# Altium project PPT_Controller.PrjPcb
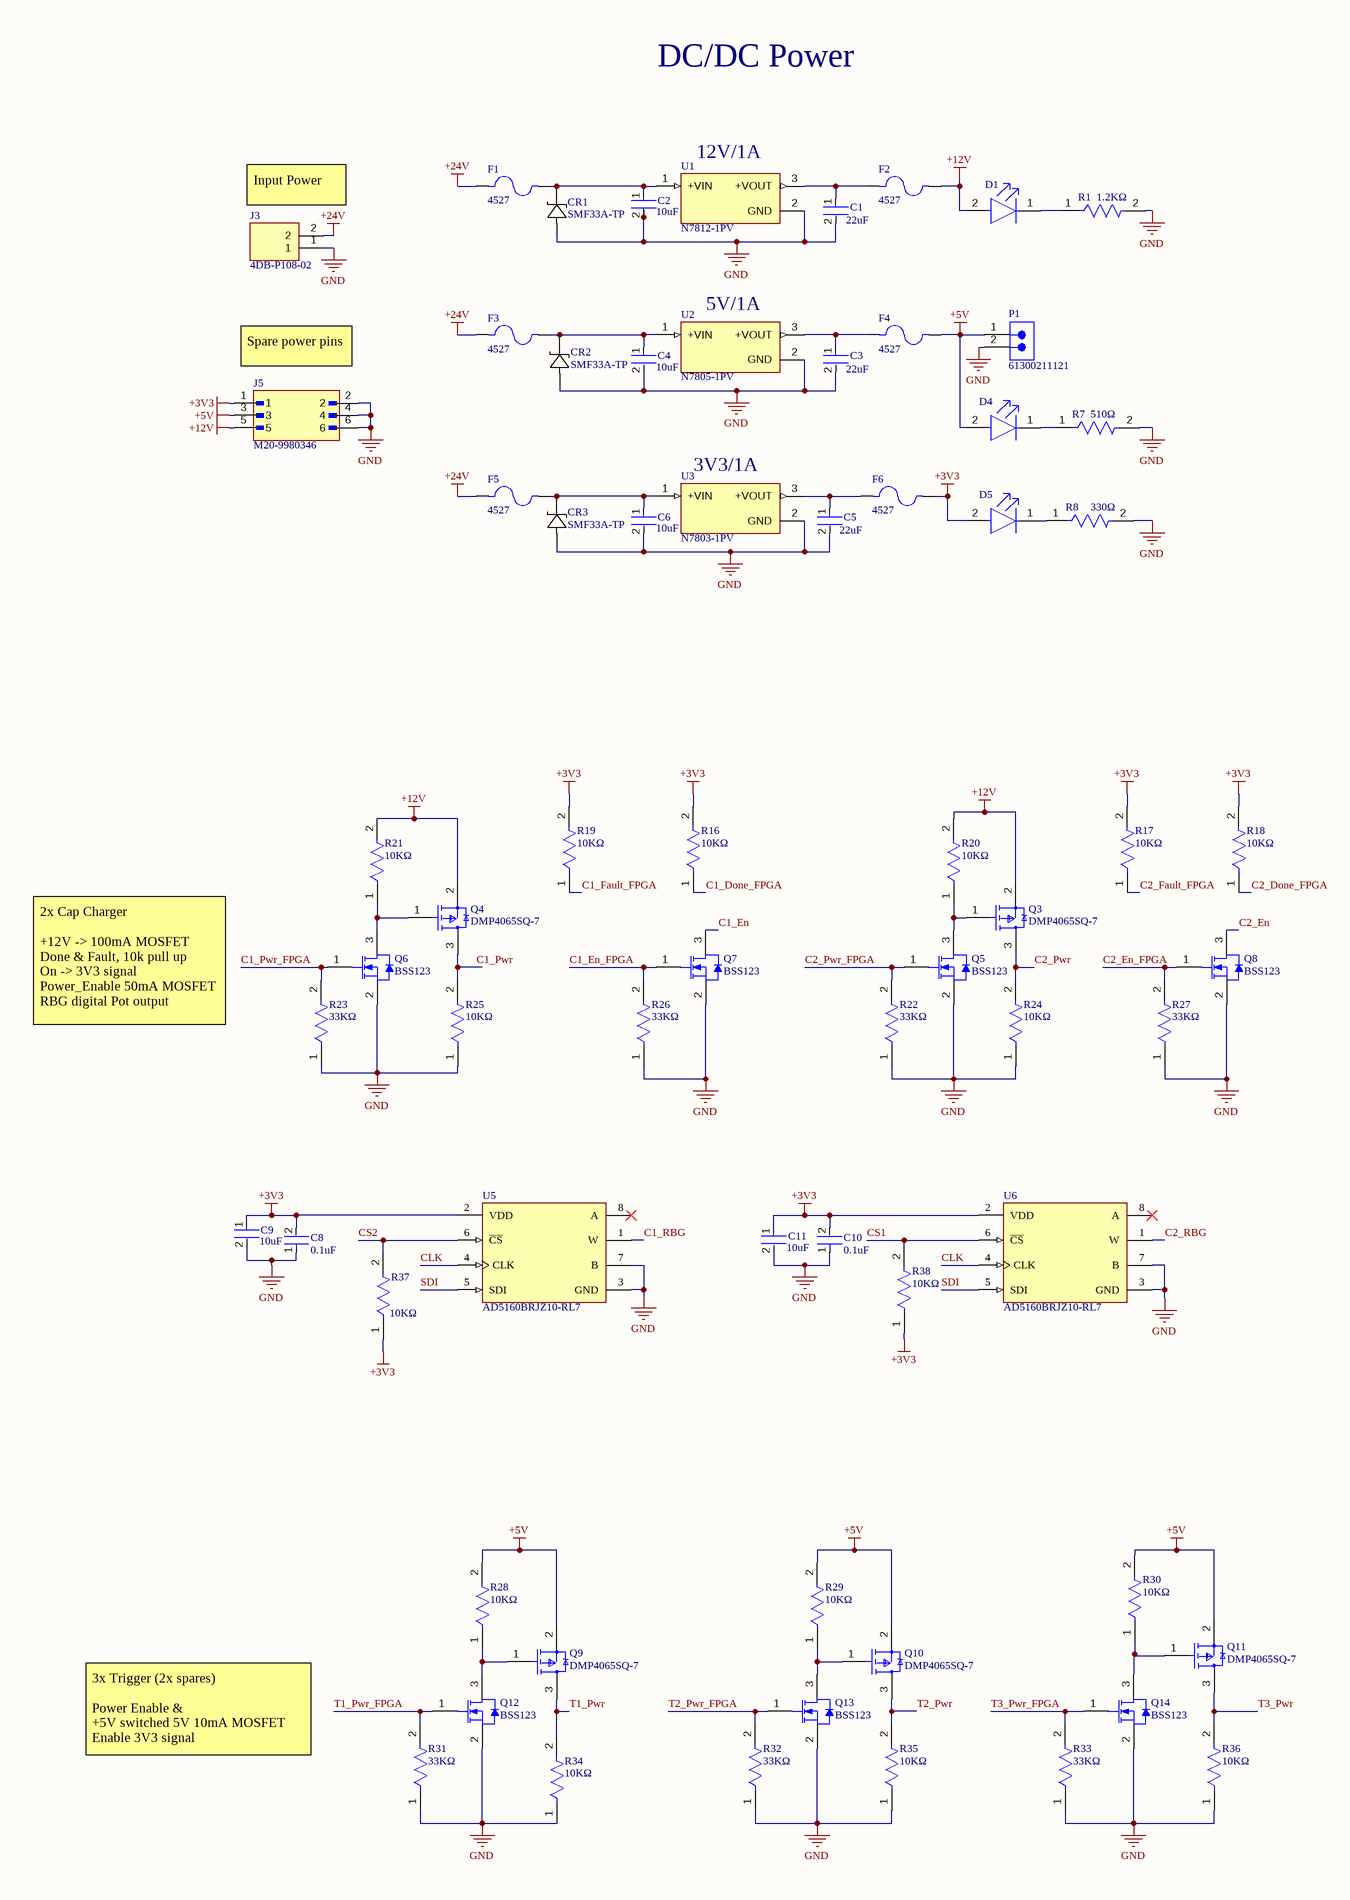
[diagram p0: Controller.SchDoc, left]
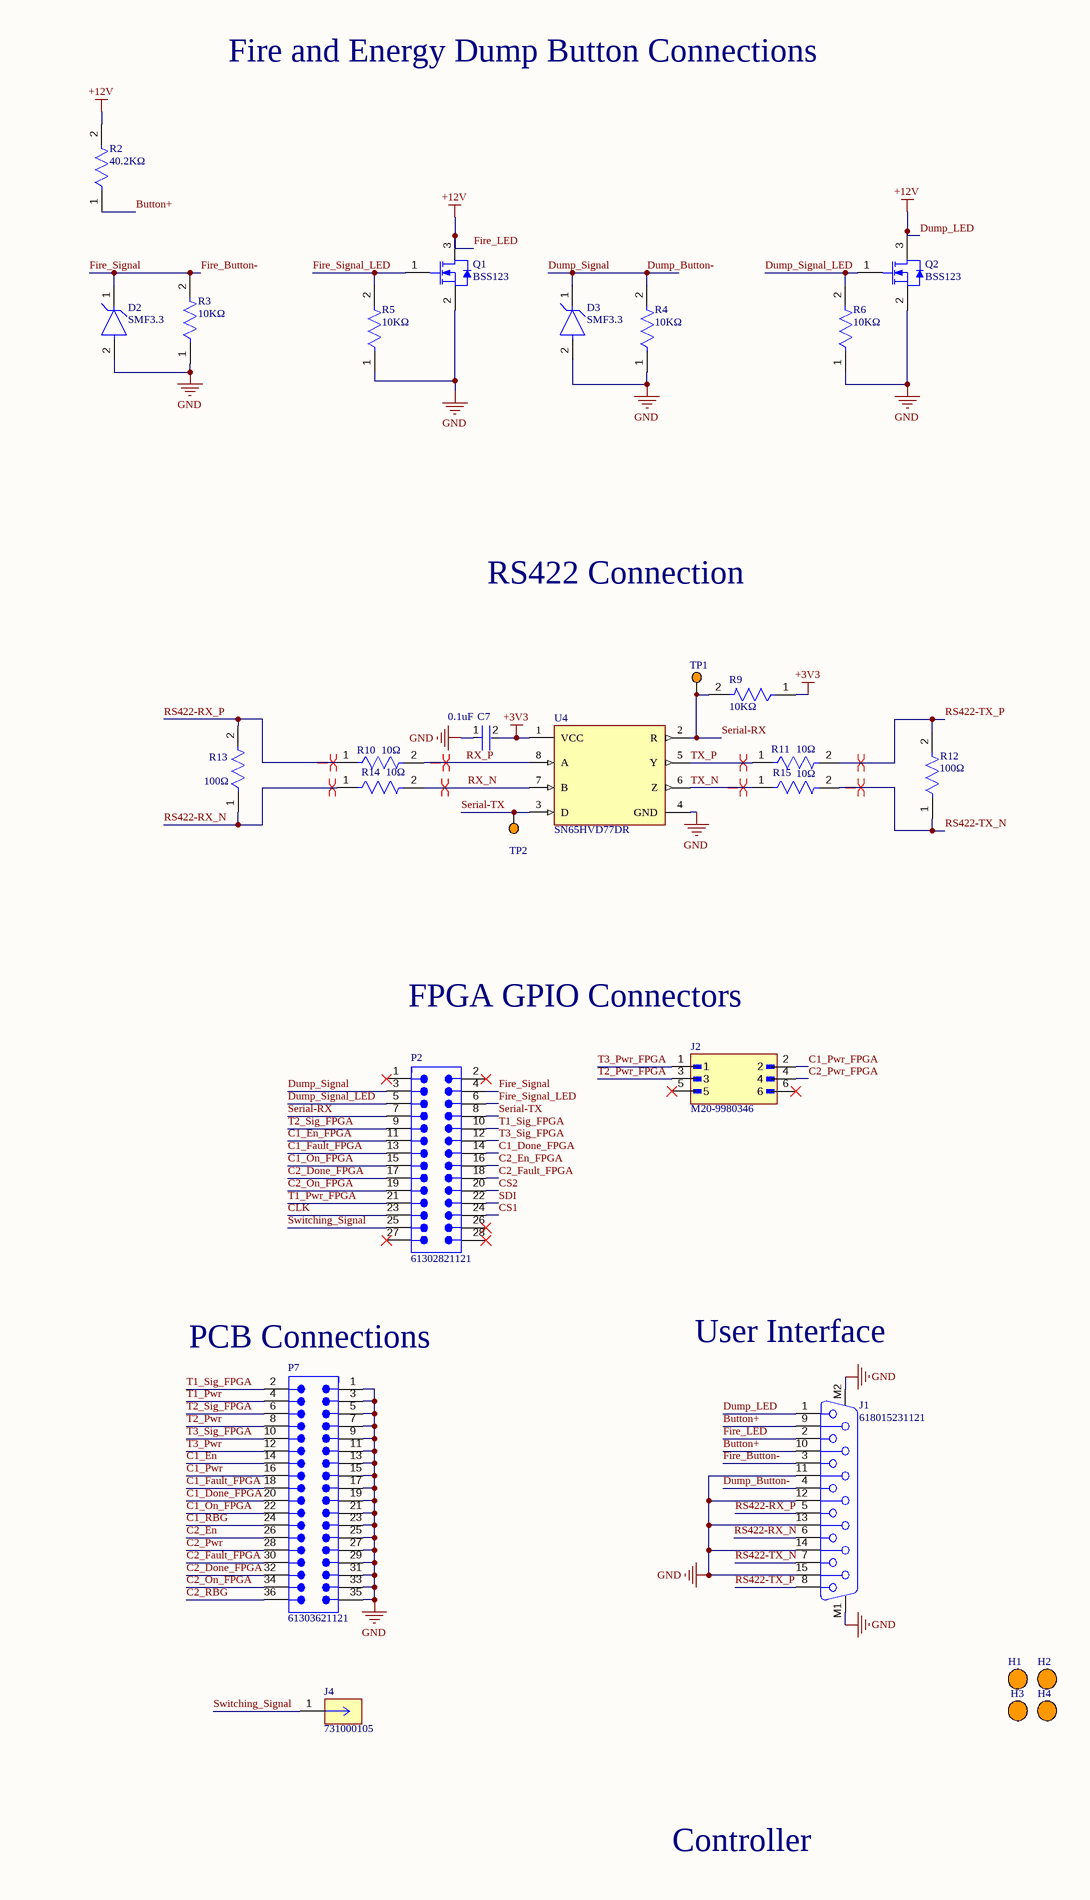
[diagram p1: Controller.SchDoc, right]
1 sheet, 97 parts. Net scope: global (net labels, ports and power ports of the same name join across sheets).
Board files: Controller.PcbDoc, fpga.PcbDoc

## Sheet Controller.SchDoc
size 558 x 431 mm; SheetNumber: 1; SheetTotal: 1

### Parts
C1  Capacitance: 22uF  [FP-CC0805-0_2-1_45-IPC_C]  (hidden comment: CC0805MKX5R8BB226)
C2  Capacitance: 10uF  [FP-CL32-IPC_C]  (hidden comment: CL32B106KBJNNNE)
C3  Capacitance: 22uF  [FP-CC0805-0_2-1_45-IPC_C]  (hidden comment: CC0805MKX5R8BB226)
C4  Capacitance: 10uF  [FP-CL32-IPC_C]  (hidden comment: CL32B106KBJNNNE)
C5  Capacitance: 22uF  [FP-CC0805-0_2-1_45-IPC_C]  (hidden comment: CC0805MKX5R8BB226)
C6  Capacitance: 10uF  [FP-CL32-IPC_C]  (hidden comment: CL32B106KBJNNNE)
C7  0.1uF  [FP-CC0603-DA-IPC_A]
C8  0.1uF  [FP-CC0603-DA-IPC_A]
C9  Capacitance: 10uF  [FP-CL32-IPC_C]  (hidden comment: CL32B106KBJNNNE)
C10  0.1uF  [FP-CC0603-DA-IPC_A]
C11  Capacitance: 10uF  [FP-CL32-IPC_C]  (hidden comment: CL32B106KBJNNNE)
CR1  SMF33A-TP  [SOD-123FL_MCC]
CR2  SMF33A-TP  [SOD-123FL_MCC]
CR3  SMF33A-TP  [SOD-123FL_MCC]
D1  LTST-C190GKT  [FP-LTST-C190GKT-MFG]  (value not drawn)
D2  SMF3.3  [FP-SMF3_3-MFG]
D3  SMF3.3  [FP-SMF3_3-MFG]
D4  LTST-C190GKT  [FP-LTST-C190GKT-MFG]  (value not drawn)
D5  LTST-C190GKT  [FP-LTST-C190GKT-MFG]  (value not drawn)
F1  4527  [FUSE_4527]
F2  4527  [FUSE_4527]
F3  4527  [FUSE_4527]
F4  4527  [FUSE_4527]
F5  4527  [FUSE_4527]
F6  4527  [FUSE_4527]
H1  M3_Hole  [M3_Hole]  (value not drawn)
H2  M3_Hole  [M3_Hole]  (value not drawn)
H3  M3_Hole  [M3_Hole]  (value not drawn)
H4  M3_Hole  [M3_Hole]  (value not drawn)
J1  618015231121  [618015231121]
J2  M20-9980346  [HARWIN_M20-9980346]
J3  4DB-P108-02  [TE_2-1437667-4]
J4  731000105  [CONN_73100-0105_MOL]
J5  M20-9980346  [HARWIN_M20-9980346]
P1  61300211121  [61300211121]
P2  61302821121  [61302821121]
P7  61303621121  [61303621121]
Q1  BSS123  [FAIR-SOT23-3_V]
Q2  BSS123  [FAIR-SOT23-3_V]
Q3  DMP4065SQ-7  [FP-SOT23-IPC_C]
Q4  DMP4065SQ-7  [FP-SOT23-IPC_C]
Q5  BSS123  [FAIR-SOT23-3_V]
Q6  BSS123  [FAIR-SOT23-3_V]
Q7  BSS123  [FAIR-SOT23-3_V]
Q8  BSS123  [FAIR-SOT23-3_V]
Q9  DMP4065SQ-7  [FP-SOT23-IPC_C]
Q10  DMP4065SQ-7  [FP-SOT23-IPC_C]
Q11  DMP4065SQ-7  [FP-SOT23-IPC_C]
Q12  BSS123  [FAIR-SOT23-3_V]
Q13  BSS123  [FAIR-SOT23-3_V]
Q14  BSS123  [FAIR-SOT23-3_V]
R1  Resistance: 1.2KΩ  [FP-RT0805-MFG]  (hidden comment: RT0805FRE071K2L)
R2  Resistance: 40.2KΩ  [FP-RT0805-MFG]  (hidden comment: RT0805BRE0740K2L)
R3  value 10KΩ  [FP-RT0805-MFG]  (hidden comment: RT0805FRE0710KL)
R4  value 10KΩ  [FP-RT0805-MFG]  (hidden comment: RT0805FRE0710KL)
R5  value 10KΩ  [FP-RT0805-MFG]  (hidden comment: RT0805FRE0710KL)
R6  value 10KΩ  [FP-RT0805-MFG]  (hidden comment: RT0805FRE0710KL)
R7  Resistance: 510Ω  [FP-RT0805-MFG]  (hidden comment: RT0805FRE07510RL)
R8  Resistance: 330Ω  [FP-RT0805-MFG]  (hidden comment: RT0805FRE07330RL)
R9  value 10KΩ  [FP-RT0805-MFG]  (hidden comment: RT0805FRE0710KL)
R10  value 10Ω  [FP-RT0805-MFG]  (hidden comment: RT0805FRE0710RL)
R11  value 10Ω  [FP-RT0805-MFG]  (hidden comment: RT0805FRE0710RL)
R12  Resistance: 100Ω  [FP-RT0805-MFG]  (hidden comment: RT0805FRE07100RL)
R13  Resistance: 100Ω  [FP-RT0805-MFG]  (hidden comment: RT0805FRE07100RL)
R14  value 10Ω  [FP-RT0805-MFG]  (hidden comment: RT0805FRE0710RL)
R15  value 10Ω  [FP-RT0805-MFG]  (hidden comment: RT0805FRE0710RL)
R16  value 10KΩ  [FP-RT0805-MFG]  (hidden comment: RT0805FRE0710KL)
R17  value 10KΩ  [FP-RT0805-MFG]  (hidden comment: RT0805FRE0710KL)
R18  value 10KΩ  [FP-RT0805-MFG]  (hidden comment: RT0805FRE0710KL)
R19  value 10KΩ  [FP-RT0805-MFG]  (hidden comment: RT0805FRE0710KL)
R20  value 10KΩ  [FP-RT0805-MFG]  (hidden comment: RT0805FRE0710KL)
R21  value 10KΩ  [FP-RT0805-MFG]  (hidden comment: RT0805FRE0710KL)
R22  value 33KΩ  [FP-RT0805-MFG]  (hidden comment: RT0805BRD0733KL)
R23  value 33KΩ  [FP-RT0805-MFG]  (hidden comment: RT0805BRD0733KL)
R24  value 10KΩ  [FP-RT0805-MFG]  (hidden comment: RT0805FRE0710KL)
R25  value 10KΩ  [FP-RT0805-MFG]  (hidden comment: RT0805FRE0710KL)
R26  value 33KΩ  [FP-RT0805-MFG]  (hidden comment: RT0805BRD0733KL)
R27  value 33KΩ  [FP-RT0805-MFG]  (hidden comment: RT0805BRD0733KL)
R28  value 10KΩ  [FP-RT0805-MFG]  (hidden comment: RT0805FRE0710KL)
R29  value 10KΩ  [FP-RT0805-MFG]  (hidden comment: RT0805FRE0710KL)
R30  value 10KΩ  [FP-RT0805-MFG]  (hidden comment: RT0805FRE0710KL)
R31  value 33KΩ  [FP-RT0805-MFG]  (hidden comment: RT0805BRD0733KL)
R32  value 33KΩ  [FP-RT0805-MFG]  (hidden comment: RT0805BRD0733KL)
R33  value 33KΩ  [FP-RT0805-MFG]  (hidden comment: RT0805BRD0733KL)
R34  value 10KΩ  [FP-RT0805-MFG]  (hidden comment: RT0805FRE0710KL)
R35  value 10KΩ  [FP-RT0805-MFG]  (hidden comment: RT0805FRE0710KL)
R36  value 10KΩ  [FP-RT0805-MFG]  (hidden comment: RT0805FRE0710KL)
R37  value 10KΩ  [FP-RT0805-MFG]  (hidden comment: RT0805FRE0710KL)
R38  value 10KΩ  [FP-RT0805-MFG]  (hidden comment: RT0805FRE0710KL)
TP1  Test Point  [Test_Pad]  (value not drawn)
TP2  Test Point  [Test_Pad]  (value not drawn)
U1  N7812-1PV  [CONV_TSR_1-2433]
U2  N7805-1PV  [CONV_TSR_1-2433]
U3  N7803-1PV  [CONV_TSR_1-2433]
U4  SN65HVD77DR  [FP-D0008A-IPC_C]
U5  AD5160BRJZ10-RL7  [FP-RJ-8-IPC_B]
U6  AD5160BRJZ10-RL7  [FP-RJ-8-IPC_B]

### Nets
+3V3: C7.2 C8.2 C9.1 C10.2 C11.1 D5.2(A) F6.2 J5.1 R9.1 R16.2 R17.2 R18.2 R19.2 R37.1 R38.1 U4.1(VCC) U5.2(VDD) U6.2(VDD)
+5V: D4.2(A) F4.2 J5.3 P1.1 Q9.2(S) Q10.2(S) Q11.2(S) R28.2 R29.2 R30.2
+24V: F1.1 F3.1 F5.1 J3.2
Dump_LED: D1.2(A) F2.2 J1.1 J1.2 J5.5 Q1.3(D) Q2.3(D) Q3.2(S) Q4.2(S) R2.2 R20.2 R21.2  [also labelled +12V, Fire_LED]
GND: C1.2 C2.2 C3.2 C4.2 C5.2 C6.2 C7.1 C8.1 C9.2 C10.1 C11.2 CR1.2 CR2.2 CR3.2 D2.2(A) D3.2(A) J1.11 J1.12 J1.13 J1.14 J1.15 J1.M1 J1.M2 J3.1 J5.2 J5.4 J5.6 P1.2 P7.1 P7.3 P7.5 P7.7 P7.9 P7.11 P7.13 P7.15 P7.17 P7.19 P7.21 P7.23 P7.25 P7.27 P7.29 P7.31 P7.33 P7.35 Q1.2(S) Q2.2(S) Q5.2(S) Q6.2(S) Q7.2(S) Q8.2(S) Q12.2(S) Q13.2(S) Q14.2(S) R1.2 R3.1 R4.1 R5.1 R6.1 R7.2 R8.2 R22.1 R23.1 R24.1 R25.1 R26.1 R27.1 R31.1 R32.1 R33.1 R34.1 R35.1 R36.1 U1.2(GND) U2.2(GND) U3.2(GND) U4.4(GND) U5.3(GND) U5.7(B) U6.3(GND) U6.7(B)
Button+: J1.9 J1.10 R2.1
C1_Done_FPGA: P2.14 P7.20 R16.1
C1_En: P7.14 Q7.3(D)
C1_En_FPGA: P2.11 Q7.1(G) R26.2
C1_Fault_FPGA: P2.13 P7.18 R19.1
C1_On_FPGA: P2.15 P7.22
C1_Pwr: P7.16 Q4.3(D) R25.2
C1_Pwr_FPGA: J2.2 Q6.1(G) R23.2
C1_RBG: P7.24 U5.1(W)
C2_Done_FPGA: P2.17 P7.32 R18.1
C2_En: P7.26 Q8.3(D)
C2_En_FPGA: P2.16 Q8.1(G) R27.2
C2_Fault_FPGA: P2.18 P7.30 R17.1
C2_On_FPGA: P2.19 P7.34
C2_Pwr: P7.28 Q3.3(D) R24.2
C2_Pwr_FPGA: J2.4 Q5.1(G) R22.2
C2_RBG: P7.36 U6.1(W)
CLK: P2.23 U5.4(CLK) U6.4(CLK)
CS1: P2.24 R38.2 U6.6(~{CS})
CS2: P2.20 R37.2 U5.6(~{CS})
Dump_Button-: D3.1(C) J1.4 P2.3 R4.2  [also labelled Dump_Signal]
Dump_Signal_LED: P2.5 Q2.1(G) R6.2
Fire_Button-: D2.1(C) J1.3 P2.4 R3.2  [also labelled Fire_Signal]
Fire_Signal_LED: P2.6 Q1.1(G) R5.2
RS422-RX_N: J1.6 R13.1 R14.1
RS422-RX_P: J1.5 R10.1 R13.2
RS422-TX_N: J1.7 R12.1 R15.2
RS422-TX_P: J1.8 R11.2 R12.2
RX_N: R14.2 U4.7(B)
RX_P: R10.2 U4.8(A)
SDI: P2.22 U5.5(SDI) U6.5(SDI)
Serial-RX: P2.7 R9.2 TP1.1(T) U4.2(R)
Serial-TX: P2.8 TP2.1(T) U4.3(D)
Switching_Signal: J4.1 P2.25
T1_Pwr: P7.4 Q9.3(D) R34.2
T1_Pwr_FPGA: P2.21 Q12.1(G) R31.2
T1_Sig_FPGA: P2.10 P7.2
T2_Pwr: P7.8 Q10.3(D) R35.2
T2_Pwr_FPGA: J2.3 Q13.1(G) R32.2
T2_Sig_FPGA: P2.9 P7.6
T3_Pwr: P7.12 Q11.3(D) R36.2
T3_Pwr_FPGA: J2.1 Q14.1(G) R33.2
T3_Sig_FPGA: P2.12 P7.10
TX_N: R15.1 U4.6(Z)
TX_P: R11.1 U4.5(Y)
NetC1_1: C1.1 F2.1 U1.3(+VOUT)
NetC2_1: C2.1 CR1.1 F1.2 U1.1(+VIN)
NetC3_1: C3.1 F4.1 U2.3(+VOUT)
NetC4_1: C4.1 CR2.1 F3.2 U2.1(+VIN)
NetC5_1: C5.1 F6.1 U3.3(+VOUT)
NetC6_1: C6.1 CR3.1 F5.2 U3.1(+VIN)
NetD1_1: D1.1(C) R1.1
NetD4_1: D4.1(C) R7.1
NetD5_1: D5.1(C) R8.1
NetQ3_1: Q3.1(G) Q5.3(D) R20.1
NetQ4_1: Q4.1(G) Q6.3(D) R21.1
NetQ9_1: Q9.1(G) Q12.3(D) R28.1
NetQ10_1: Q10.1(G) Q13.3(D) R29.1
NetQ11_1: Q11.1(G) Q14.3(D) R30.1

Not connected (* = marked no-connect by the designer): J2 5* 6*; P2 1* 2* 26* 27* 28*; U5 8(A)*; U6 8(A)*

### Layout directives
differential pair: RS422-RX_N, RS422-RX_P, RS422-TX_N, RS422-TX_P, RX_N, RX_P, TX_N, TX_P

### Notes on the sheet
- DC/DC Power
- Fire and Energy Dump Button Connections
- (near U1) 12V/1A
- (near J3) Input Power
- (near J5) Spare power pins
- (near U2) 5V/1A
- (near U3) 3V3/1A
- RS422 Connection
- 2x Cap Charger
  +12V -> 100mA MOSFET
  Done & Fault, 10k pull up
  On -> 3V3 signal
  Power_Enable 50mA MOSFET
  RBG digital Pot output
- FPGA GPIO Connectors
- (near P7) PCB Connections
- User Interface
- 3x Trigger (2x spares)
  Power Enable &
  +5V switched 5V 10mA MOSFET
  Enable 3V3 signal
- Controller
- DWG. NO.
- REV.
- SHT.
- REVISION
- DESCRIPTION
- DATE
- APPROVED
- THIS DOCUMENT AND THE DATA DISCLOSED HEREIN OR HEREWITH IS THE PROPERTY OF ALTIUM LIMITED AND MAY BE FREELY DISTRIBUTED IN WHOLE. NO RIGHTS ARE RESERVED OR EXPRESS OR IMPLIED WARANTEE GIVEN.
- ENG:
- DSN:
- APPROVALS
- PROJECT
- DOCUMENT REVISION:
- DESIGN ITEM:
- CHK:
- BOM:
- REFERENCE DOCUMENTS
- PROJECT REVISION:
- TITLE
- FAB DWG:
- PCB DWG:
- ASSY DWG:
- SCALE:
- SIZE
- C
- CAGE CODE
- FILE NAME
- DWG NO.
- SHEET
- OF
- REV

### Library data of the parts
C1 C3 C5 = CMP-03422-001497-1: CAP CER 22UF 25V X5R 0805; Tolerance: 20%; Max Operating Temperature: 85°C; Dielectric: X5R; Termination: SMD/SMT; Voltage Rating: 25V; Width: 0.049inch; Min Operating Temperature: -55°C; Case/Package: 0805; Lead Free: Lead Free; RoHS Compliant: Yes; Weight: 0.000194oz; Voltage Rating (DC): 25V; Length: 0.079inch; Halogen Free: Halogen Free; Height: 1.25mm; Packaging: Tape and Reel; Package Quantity: 3000; Case Code (Metric): 2012; Thickness: 0.057inch; Case Code (Imperial): 0805; Mount: Surface Mount
C2 C4 C6 C9 C11 = CMP-2000-06110-2: Cap Ceramic 10uF 50V X7R ±10% SMD 1210 +125°C Embossed T/R; Material: Ceramic; Min Operating Temperature: -55°C; Depth: 2.5mm; Radiation Hardening: No; Packaging: Tape and Reel; Dielectric: X7R; Case Code (Metric): 3225; Height: 2.5mm; Thickness: 0.106inch; Voltage Rating (DC): 50V; Voltage Rating: 50V; Width: 0.098inch; Case Code (Imperial): 1210; Length: 3.2mm; Tolerance: 10%; Lead Free: Lead Free; Package Quantity: 1; Voltage: 50V; Mount: Surface Mount; Case/Package: 1210; Max Operating Temperature: 125°C
C7 C8 C10 = CMP-03422-001490-1: CC0603JRX7R9BB104 / CAP CER 0.1UF 50V X7R 0603; Manufacturer: Yageo; Capacitance: 100nF; Tolerance: 5%; Number of Pins: 2; Depth: 0.8mm; Weight: 7.1E-05oz; Radiation Hardening: No; Case Code (Metric): 1608; Dielectric: X7R; Max Operating Temperature: 125°C; Voltage Rating (DC): 50V; Case/Package: 0603; Halogen Free: Halogen Free; Mount: Surface Mount; Lead Free: Lead Free; Termination: SMD/SMT; RoHS Compliant: Yes; Length: 1.6mm; Series: CC; Resistor Type: Ceramic; Case Code (Imperial): 0603; Construction: Flat; Width: 0.031inch; Height: 0.8mm; Voltage Rating: 50V; Min Operating Temperature: -55°C; Thickness: 0.035inch; Packaging: Tape and Reel; Manufacturer Part Number: CC0603JRX7R9BB104
CR1-CR3 = SMF33A-TP: No Description Available; Manufacturer_Name: MCC; Copyright: Copyright (C) 2025 Ultra Librarian. All rights reserved.; Manufacturer_Part_Number: SMF33A-TP
D1 D4 D5 = CMP-22017-000005-2: LED GREEN CLEAR CHIP SMD; Dominant Wavelength: 569nm; Reverse Voltage: 5V; Lens Color: Colorless; Viewing Angle: 130°; Voltage: 2V; Forward Current: 30mA; Power Dissipation: 100mW; Luminous Intensity: 6mcd; Number of LEDs: 1; Forward Voltage: 2.1V; Wavelength: 565nm; Test Current: 10mA; Min Operating Temperature: -55°C; Lens Style: Clear; Mount: Surface Mount; Width: 0.8mm; Packaging: Tape and Reel; Lens Transparency: Clear; Case Code (Metric): 1608; Depth: 0.8mm; Case Code (Imperial): 0603; Case/Package: 0603; Number of Pins: 2; Max Operating Temperature: 85°C; Lead Free: Lead Free; Number of Elements: 1; Length: 1.6mm; Height: 0.8mm; Package Quantity: 1; Power Rating: 100mW; Radiation Hardening: No; Illumination Color: Green; Color: Green
D2 D3 = CMP-08607-000053-1: TVS DIODE 3.3V 6.8V SOD123FL; Manufacturer: Littelfuse; Max Junction Temp: +150°C; Number Of Channels: 1; Peak Pulse Current: 30A; Standoff Height: 0mm; Direction: Unidirectional; Peak Pulse Power: 200W; Breakdown Voltage: 3.4V; Manufacturer Part Number: SMF3.3; Device Class L2: TVS Diodes; Package: 0; Reverse Standoff Voltage: 3.3V; RoHS: TRUE; Temperature: -55°C to +150°C; Lead Free: Yes; ComponentLink2Description: Datasheet; Device Class L3: unset; Octopart: https://octopart.com/smf3.3-littelfuse-75449841; Temperature Range High: +150°C; Mouser Description: Diode TVS Single Uni-Dir 3.3V 1.2KW 2-Pin SOD-123FL T/R; Digikey Description: TVS DIODE 3.3V 6.8V SOD123FL; Height: 1.08mm; Device Class L1: Circuit Protection; ComponentLink2URL: https://www.littelfuse.com/~/media/electronics/datasheets/tvs_diodes/littelfuse_tvs_diode_smf3_3_datasheet.pdf.pdf; Automotive: No; Temperature Range Low: -55°C; Category: Diode; Clamping Voltage: 6.8V
F1-F6 = 4527: 5mm Low Profile Holder; MF: Keystone; MP: 4527; Price: None; Purchase-URL: https://pricing.snapeda.com/search/part/4527/?ref=eda; Package: None; Availability: In Stock; SnapEDA_Link: https://www.snapeda.com/parts/4527/Keystone+Electronics/view-part/?ref=snap; Value: *; Check_prices: https://www.snapeda.com/parts/4527/Keystone+Electronics/view-part/?ref=eda
J1 = CMP-1502-00201-2: NexarPartId: 18818196; Voltage Rating: 125V; Gender: Female; Current Rating: 3A; Contact Resistance: 30mΩ; Pitch: 2.77mm; Number of Contacts: 15; Insulation Resistance: 5GΩ; REACH SVHC: Unknown; Insulation Material: PBT; Number of Rows: 2; Width: 12.5mm; Contact Plating: Gold; RoHS: Compliant; Depth: 18.5mm; Housing Material: Steel; Mount: Through Hole; Orientation: Right Angle; Max Operating Temperature: 105°C; Min Operating Temperature: -55°C; Length: 39.2mm; Number of Pins: 15; Operating Supply Voltage: 125V; Termination: SMD/SMT
J3 = 4DB-P108-02: Conn; Term Strip; Barrier; 2Pole; 8.26mmPitch; SnglRow; 22-12; Series 4DB; 20A; 150V; MF: TE Connectivity; Value: *; MP: 4DB-P108-02; TE_purchase_URL: https://www.te.com/usa-en/product-2-1437667-4.html?te_bu=Cor&te_type=disp&te_campaign=seda_glo_cor-seda-global-disp-prtnr-fy19-seda-model-bom-cta_sma-317_1&elqCampaignId=32493; Package: None; Price: None; Availability: Unavailable; SnapEDA_Link: https://www.snapeda.com/parts/4DB-P108-02/TE%20Connectivity%20AMP%20Connectors/view-part/2743721/?ref=snap
J4 = 731000105: BNC JACK, RA, RECEPTACLE, 50 OHM | Molex Incorporated 73100-0105; SnapEDA_Link: https://www.snapeda.com/parts/73100-0105/Molex/view-part/?ref=snap; Package: None; Value: *; MF: Molex; MP: 73100-0105; Check_prices: https://www.snapeda.com/parts/73100-0105/Molex/view-part/?ref=eda
P1 = CMP-1712-00002-6: NexarPartId: 20081794; Number of Contacts: 2; Pitch: 2.54mm; Connector Type: Male Pin; Voltage Rating: 250V; Current Rating: 3A; Gender: Male; Contact Resistance: 20mΩ; Height: 8.94mm; Lead Free: Lead Free; Number of Pins: 2; Termination: Through Hole; RoHS: Compliant; Lead Pitch: 2.54mm; REACH SVHC: No SVHC; Housing Material: PBT; Contact Mating Length: 5.9944mm; Min Operating Temperature: -40°C; Orientation: Vertical; Contact Material: Copper; Contact Gender: Male; Max Operating Temperature: 125°C; Number of Rows: 1; Number of Positions: 2; Packaging: Bulk; Contact Plating: Gold; Mount: Through Hole; Color: Black; Operating Supply Voltage: 250V
P2 = CMP-1502-01115-3: NexarPartId: 32855566; Pitch: 2.54mm; Current Rating: 3A; Gender: Male; Connector Type: Male Pin; Number of Positions: 28; Contact Resistance: 20mΩ; Operating Supply Voltage: 250V; Packaging: Bulk; Number of Rows: 2; REACH SVHC: Unknown; RoHS: Compliant; Termination: Solder; Lead Pitch: 2.54mm; Contact Material: Copper; Number of Pins: 28; Row Spacing: 2.54mm; Orientation: Vertical; Contact Mating Length: 5.9944mm; Contact Plating: Gold; Color: Black; Mount: Through Hole; Number of Contacts: 28
P7 = CMP-1502-01131-3: NexarPartId: 32855576; Operating Supply Voltage: 250V; Connector Type: Male Pin; Gender: Male; Pitch: 2.54mm; Contact Resistance: 20mΩ; Current Rating: 3A; Number of Contacts: 36; Contact Material: Copper; Orientation: Vertical; Contact Mating Length: 5.9944mm; Mount: Through Hole; REACH SVHC: Unknown; RoHS: Compliant; Packaging: Bulk; Number of Rows: 2; Number of Positions: 36; Color: Black; Lead Pitch: 2.54mm; Row Spacing: 2.54mm; Number of Pins: 36; Contact Plating: Gold; Termination: Solder
Q1 Q2 = CMP-2000-04934-1: N-Channel Logic Level Enhancement Mode Field Effect Transistor, 1.7 V, -55 to 150 degC, 3-Pin SOT-23, RoHS, Tape and Reel; Manufacturer: Fairchild; Channel Type: N; Typical Turn-Off Delay Time: 17ns; Maximum Continuous Drain Current: 0.17A; Rad Hard: No; Typical Rise Time: 9ns; Typical Fall Time: 2.4ns; Maximum Gate Source Voltage: ±20V; Maximum Drain Source Voltage: 100V; Typical Turn-On Delay Time: 1.7ns; RDS-on: 6000@10VmOhm; Package Version: Rev. 12, 03/2016; Packaging: Tape&Reel; Package Reference: SOT23-3; Channel Mode: Enhancement; Operating Temperature: -55to150degC; Package Description: 3-Pin Small Outline Transistor, Body 2.92 x 1.325 mm, Pitch 0.95 mm; Category: MOSFET; Datasheet Version: Jun-03; Datasheet URL: https://www.fairchildsemi.com/datasheets/BS/BSS123.pdf; Manufacturer URL: https://www.fairchildsemi.com/; Mounting: SurfaceMount; Package: 3SOT-23; Package URL: http://www.fairchildsemi.com/dwg/MA/MA03D.pdf
Q3 Q4 Q9-Q11 = CMP-013-00042-2: Mosfet, P-Ch, 40V, 2.4A, 150Deg C, 0.72W; Manufacturer: Diodes Inc; Rds On Max: 80mR; Input Capacitance: 587pF; Max Power Dissipation: 720mW; Continuous Drain Current (ID): 2.4A; Manufacturer Part Number: DMP4065SQ-7; Min Operating Temperature: -55°C; Drain to Source Voltage (Vdss): 40V; Max Operating Temperature: 150°C; Case/Package: SOT-23
Q5-Q8 Q12-Q14 = CMP-013-00035-1: Transistor MOSFET Negative Channel 100 Volt 0.17A 3-Pin SOT-23; Manufacturer: On Semi; Gate to Source Voltage (Vgs): 20V; Drain to Source Breakdown Voltage: 100V; Polarity: N-CHANNEL; Drain to Source Resistance: 1.2R; Max Power Dissipation: 360mW; Drain-source On Resistance-Max: 6R; Nominal Vgs: 1.7V; Turn-On Delay Time: 1.7ns; Continuous Drain Current (ID): 170mA; Turn-Off Delay Time: 17ns; Value: BSS123; Min Operating Temperature: -55°C; Max Operating Temperature: 150°C; Manufacturer Part Number: BSS123; Drain to Source Voltage (Vdss): 100V; Case/Package: SOT-23; Voltage Rating (DC): 100V
R1 = CMP-03412-024244-1: RES SMD 1.2K OHM 1% 1/8W 0805; Manufacturer: Yageo; Temperature Coefficient: 50 ppm/°C; Tolerance: 0.0001; Value: 1.2KΩ; Power Rating: 0.125W; Voltage Rating: 150V; Temperature: -55°C to +155°C; Category: Res; Device Class L1: Passive Components; Digikey Description: RES SMD 1.2K OHM 1% 1/8W 0805; Package: RT0805; Composition: Thin Film; ComponentLink2URL: http://www.yageo.com/documents/recent/PYu-RT_1-to-0.01_RoHS_L_9.pdf; Device Class L3: Chip SMD Resistors; Temperature Range High: +155°C; Octopart: https://octopart.com/rt0805fre071k2l-yageo-40048706; Mouser Description: Thin Film Resistors - SMD 1/8W 1.2K ohm 1% 50ppm; Device Class L2: Resistors; RoHS: TRUE; Manufacturer Part Number: RT0805FRE071K2L; Lead Free: Yes; ComponentLink2Description: Datasheet; Ipc Land Pattern Name: RESC200125X50; Automotive: No; Temperature Range Low: -55°C; Height: 0.6mm; Footprint Url: http://www.yageo.com/exep/pages/download/literatures/PYu-R_Mount_10.pdf; Series: RT
R2 = CMP-2001-01705-2: RES SMD 40.2K OHM 0.1% 1/8W 0805; Manufacturer: Yageo; Tolerance: 0.0025; Power Rating: 0.125W; Value: 40.2KΩ; Temperature Coefficient: 50 ppm/°C; Voltage Rating: 150V; Temperature Range High: +155°C; Digikey Description: RES SMD 40.2K OHM 0.1% 1/8W 0805; Height: 0.6mm; Temperature: -55°C to +155°C; Manufacturer Part Number: RT0805BRE0740K2L; RoHS: TRUE; ComponentLink2URL: http://www.yageo.com/documents/recent/PYu-RT_1-to-0.01_RoHS_L_9.pdf; Footprint Url: http://www.yageo.com/exep/pages/download/literatures/PYu-R_Mount_10.pdf; Package: RT0805; Lead Free: Yes; Device Class L3: Chip SMD Resistors; Device Class L2: Resistors; ComponentLink2Description: Datasheet; Series: RT; Composition: Thin Film; Automotive: No; Category: Res; Ipc Land Pattern Name: RESC200125X50; Octopart: https://octopart.com/rt0805bre0740k2l-yageo-1373674; Temperature Range Low: -55°C; Device Class L1: Passive Components
R3-R6 R9 R16-R21 R24 R25 R28-R30 R34-R38 = CMP-03412-023097-1: RES 10.0K OHM 1/8W 1% SMD 0805; Manufacturer: Yageo; Tolerance: 0.0001; Temperature Coefficient: 50 ppm/°C; Power Rating: 0.125W; Voltage Rating: 150V; ComponentLink2Description: Datasheet; Temperature: -55°C to +155°C; Digikey Description: RES 10.0K OHM 1/8W 1% SMD 0805; Automotive: No; Octopart: https://octopart.com/rt0805fre0710kl-yageo-40301150; Composition: Thin Film; Resistance: 10KΩ; RoHS: TRUE; Category: Res; Device Class L2: Resistors; Package: RT0805; ComponentLink2URL: http://www.yageo.com/documents/recent/PYu-RT_1-to-0.01_RoHS_L_9.pdf; Ipc Land Pattern Name: RESC200125X50; Height: 0.6mm; Footprint Url: http://www.yageo.com/exep/pages/download/literatures/PYu-R_Mount_10.pdf; Device Class L3: Chip SMD Resistors; Manufacturer Part Number: RT0805FRE0710KL; Temperature Range High: +155°C; Lead Free: Yes; Mouser Description: Thin Film Resistors 1/8W 10K ohm 1% 50ppm; Temperature Range Low: -55°C; Series: RT; Device Class L1: Passive Components
R7 = CMP-2001-01701-2: RES SMD 510 OHM 1% 1/8W 0805; Manufacturer: Yageo; Power Rating: 0.125W; Temperature Coefficient: 50 ppm/°C; Voltage Rating: 150V; Value: 510Ω; Tolerance: 0.0001; Temperature: -55°C to +155°C; Lead Free: Yes; Series: RT; Temperature Range Low: -55°C; ComponentLink2URL: http://www.yageo.com/documents/recent/PYu-RT_1-to-0.01_RoHS_L_9.pdf; Composition: Thin Film; Category: Res; RoHS: TRUE; Automotive: No; Height: 0.6mm; Manufacturer Part Number: RT0805FRE07510RL; Digikey Description: RES SMD 510 OHM 1% 1/8W 0805; ComponentLink2Description: Datasheet; Octopart: https://octopart.com/rt0805fre07510rl-yageo-1378875; Footprint Url: http://www.yageo.com/exep/pages/download/literatures/PYu-R_Mount_10.pdf; Package: RT0805; Device Class L3: Chip SMD Resistors; Mouser Description: Res Thin Film 0805 510 Ohm 1% 1/8W ±50ppm/°C Molded SMD SMD Paper T/R; Device Class L1: Passive Components; Ipc Land Pattern Name: RESC200125X50; Temperature Range High: +155°C; Device Class L2: Resistors
R8 = CMP-03412-000042-1: Res Thin Film 0805 330K Ohm 1% 1/8W ±50ppm/°C Molded SMD SMD Paper T/R; Manufacturer: Yageo; Value: 330Ω; Power Rating: 0.125W; Tolerance: 0.0001; Voltage Rating: 150V; Manufacturer Part Number: RT0805FRE07330RL; Height: 0.6mm; Octopart: https://octopart.com/rt0805fre07330rl-yageo-39785396; Package: RT0805; Temperature: -55°C to +155°C; Category: Res; RoHS: TRUE; ComponentLink2Description: Datasheet; Automotive: No; Device Class L3: Chip SMD Resistors; Temperature Range High: +155°C; Device Class L1: Passive Components; Temperature Coefficient: 50 ppm/°C; Series: RT; Composition: Thin Film; Digikey Description: Res Thin Film 0805 330K Ohm 1% 1/8W ±50ppm/°C Molded SMD SMD Paper T/R; Mouser Description: Res Thin Film 0805 330K Ohm 1% 1/8W ±50ppm/°C Molded SMD SMD Paper T/R; Device Class L2: Resistors; Temperature Range Low: -55°C; Ipc Land Pattern Name: RESC200125X50; Lead Free: Yes; ComponentLink2URL: http://www.yageo.com/documents/recent/PYu-RT_1-to-0.01_RoHS_L_9.pdf; Footprint Url: http://www.yageo.com/exep/pages/download/literatures/PYu-R_Mount_10.pdf
R10 R11 R14 R15 = CMP-03412-028725-1: RES SMD 10 OHM 1% 1/8W 0805; Manufacturer: Yageo; Tolerance: 0.0001; Temperature Coefficient: 50 ppm/°C; Voltage Rating: 150V; Power Rating: 0.125W; Package: RT0805; Lead Free: Yes; Manufacturer Part Number: RT0805FRE0710RL; Series: RT; Footprint Url: http://www.yageo.com/exep/pages/download/literatures/PYu-R_Mount_10.pdf; Temperature Range High: +155°C; Temperature Range Low: -55°C; Octopart: https://octopart.com/rt0805fre0710rl-yageo-39855890; Height: 0.6mm; Device Class L1: Passive Components; Mouser Description: High Precision-High Stability Chip Resistor Thin Film 0805 10Ohm 1% Paper T/R; ComponentLink2URL: http://www.yageo.com/documents/recent/PYu-RT_1-to-0.01_RoHS_L_9.pdf; Device Class L2: Resistors; Composition: Thin Film; Device Class L3: Chip SMD Resistors; Automotive: No; RoHS: TRUE; Ipc Land Pattern Name: RESC200125X50; Temperature: -55°C to +155°C; ComponentLink2Description: Datasheet; Resistance: 10Ω; Category: Res; Digikey Description: RES SMD 10 OHM 1% 1/8W 0805
R12 R13 = CMP-03412-013069-1: RES SMD 100 OHM 1% 1/8W 0805; Manufacturer: Yageo; Voltage Rating: 150V; Temperature Coefficient: 50 ppm/°C; Tolerance: 0.0001; Power Rating: 0.125W; Value: 100Ω; Device Class L1: Passive Components; RoHS: TRUE; Digikey Description: RES SMD 100 OHM 1% 1/8W 0805; Composition: Thin Film; Mouser Description: Thin Film Resistors 100 OHM 1% 50PPM; Category: Res; Temperature Range High: +155°C; Series: RT; Octopart: https://octopart.com/rt0805fre07100rl-yageo-39834046; Lead Free: Yes; Height: 0.6mm; Package: RT0805; Automotive: No; Footprint Url: http://www.yageo.com/exep/pages/download/literatures/PYu-R_Mount_10.pdf; Device Class L2: Resistors; ComponentLink2Description: Datasheet; Manufacturer Part Number: RT0805FRE07100RL; Temperature: -55°C to +155°C; Device Class L3: Chip SMD Resistors; Ipc Land Pattern Name: RESC200125X50; ComponentLink2URL: http://www.yageo.com/documents/recent/PYu-RT_1-to-0.01_RoHS_L_9.pdf; Temperature Range Low: -55°C
R22 R23 R26 R27 R31-R33 = CMP-2001-01737-2: RES 33.0K OHM 1/8W .1% SMD 0805; Manufacturer: Yageo; Tolerance: 0.0025; Power Rating: 0.125W; Temperature Coefficient: 25 ppm/°C; Voltage Rating: 150V; Temperature: -55°C to +155°C; RoHS: TRUE; Temperature Range High: +155°C; Lead Free: Yes; Height: 0.6mm; Automotive: No; Package: RT0805; Series: RT; Resistance: 33KΩ; Ipc Land Pattern Name: RESC200125X50; Device Class L3: Chip SMD Resistors; ComponentLink2URL: http://www.yageo.com/documents/recent/PYu-RT_1-to-0.01_RoHS_L_9.pdf; Mouser Description: Thin Film Resistors - SMD 1/8W 33K ohm .1% 25ppm; Device Class L2: Resistors; Octopart: https://octopart.com/rt0805brd0733kl-yageo-1457874; Device Class L1: Passive Components; Composition: Thin Film; Temperature Range Low: -55°C; ComponentLink2Description: Datasheet; Digikey Description: RES 33.0K OHM 1/8W .1% SMD 0805; Category: Res; Manufacturer Part Number: RT0805BRD0733KL; Footprint Url: http://www.yageo.com/exep/pages/download/literatures/PYu-R_Mount_10.pdf
TP1 TP2 = Test Point: Just a Pad; Manufacturer: Keystone Electronics; Manufacturer Part Number: 5003; Plating: Silver; Body Material: PBT; Forward Current: 3A; Forward Voltage: 1.08V; Inside Diameter: 1.27mm; Outside Diameter: 2.54mm; Supplier: Digikey; Supplier Part Number: 36-5003-ND; RoHS: Yes; Category: Connectors; Stock: 130387; Pricing: 1=0.39, 10=0.293, 25=0.2624, 100=0.2223, 500=0.18446, 1000=0.1739, 2500=0.1542, 5000=0.14312 (USD); Mounting Technology: PCB,Through Hole; Pins: 1; Contact Material: Bronze; Contact Plating: Silver,Tin; Material: Nylon,Bronze,Silver; Color: Orange,White; Weight: 4.535924g; Package Quantity: 10; Packaging: Bulk; Series: THM; Termination: Through Hole; Length: 7.62mm; Width: 6.35mm; Height: 0.3inch; Radiation Hardening: No; Reach SVHC Compliant: No; Lead Free: Lead Free; RoHS Compliant: Yes; Flammability Rating: UL94 V-0; ComponentLink1URL: https://datasheet.ciiva.com/4598/5000-5004-4598618.pdf?src-supplier=Mouser; ComponentLink1Description: https://datasheet.ciiva.com/4598/5000-5004-4598618.pdf?src-supplier=Mouser; ComponentLink2URL: https://datasheet.ciiva.com/16885/70182825-16885788.pdf?src-supplier=Allied+Electronics; ComponentLink2Description: https://datasheet.ciiva.com/16885/70182825-16885788.pdf?src-supplier=Allied+Electronics; ComponentLink3URL: https://datasheet.ciiva.com/1454/1703983-1454826.pdf?src-supplier=Element14; ComponentLink3Description: https://datasheet.ciiva.com/1454/1703983-1454826.pdf?src-supplier=Element14; ComponentLink4URL: https://datasheet.ciiva.com/22631/1703983-22631103.pdf?src-supplier=Element14; ComponentLink4Description: https://datasheet.ciiva.com/22631/1703983-22631103.pdf?src-supplier=Element14
U1 = N7812-1PV: DC-DC Regulated Power Supply Module, 2 Output, 12W, Hybrid; Manufacturer: Mean Well; Supplier: Mouser; Supplier Part Number: 709-N7812-1PV; Manufacturer Part Number: N7812-1PV; RoHS: No; Stock: 1473; Pricing: 1=3.29, 10=3.23, 50=3.23, 100=3.23, 1000=3.18, 10000=2.86 (USD); Reach SVHC Compliant: Yes; RoHS Compliant: No; ComponentLink1URL: https://datasheet.octopart.com/N7812-1PV-Mean-Well-datasheet-155797355.pdf?src-supplier=TME; ComponentLink1Description: https://datasheet.octopart.com/N7812-1PV-Mean-Well-datasheet-155797355.pdf?src-supplier=TME
U2 = N7805-1PV: Dc-Dc Converter, 5V, 1A Rohs Compliant: Yes; Manufacturer: Mean Well; Supplier: Mouser; Supplier Part Number: 709-N7805-1PV; Manufacturer Part Number: N7805-1PV; RoHS: No; Category: Power Products; Stock: 204; Pricing: 1=3.29, 10=3.23, 50=3.23, 100=3.19, 1000=2.98, 10000=2.66 (USD); ComponentLink1URL: https://datasheet.octopart.com/N7805-1PV-Mean-Well-datasheet-155797355.pdf?src-supplier=TME; ComponentLink1Description: https://datasheet.octopart.com/N7805-1PV-Mean-Well-datasheet-155797355.pdf?src-supplier=TME
U3 = N7803-1PV: Dc-Dc Converter, 3.3V, 1A Rohs Compliant: Yes; Manufacturer: Mean Well; Supplier: Mouser; Supplier Part Number: 709-N7803-1PV; Manufacturer Part Number: N7803-1PV; RoHS: No; Category: Power Products; Stock: 21; Pricing: 1=3.94, 10=3.88, 50=3.88, 100=3.23, 1000=3.12, 10000=2.92 (USD); ComponentLink1URL: https://datasheet.octopart.com/N7803-1PV-Mean-Well-datasheet-155797355.pdf?src-supplier=TME; ComponentLink1Description: https://datasheet.octopart.com/N7803-1PV-Mean-Well-datasheet-155797355.pdf?src-supplier=TME
U4 = CMP-04875-000104-1: IC TRANSCEIVER FULL 1/1 8SOIC; Manufacturer: Texas Instruments; Operating Supply Voltage: 3.3V; Number of Transmitters: 1; Receiver Hysteresis: 70mV; Logic Function: Receiver; Simplex/Duplex: Full Duplex; Data Rate: 50Mbps; Case/Package: SOIC; Lead Free: Lead Free; Mount: Surface Mount; Max Operating Temperature: 125°C; Number of Pins: 8; Min Operating Temperature: -40°C; Packaging: Tape and Reel; RoHS Compliant: Yes; Manufacturer Part Number: SN65HVD77DR
U5 U6 = CMP-09083-000016-1: IC DGT POT 10KOHM 256TAP SOT23-8; Number of Elements: 1; Number of Taps: 256; -3db Bandwidth: 1.2MHz; Nominal Supply Current: 3uA; Operating Supply Voltage: 5.5V; Interface: SPI; Resistance Tolerance: 15%; Frequency: 25MHz; Resistance: 10kR; Temperature Coefficient: 35ppm/°C; Min Supply Voltage: 2.7V; Memory Type: Volatile; Mount: Surface Mount; Package Quantity: 1; Taper: Linear; Series: -; Number of Circuits: 1; Number of Channels: 1; Lead Free: Contains Lead; Number of Pins: 8; Number of Positions: 256; Supply Current: 3uA; Min Operating Temperature: -40°C; Quiescent Current: 3uA; Packaging: Tape and Reel; Max Supply Current: 3uA; Operating Supply Current: 3uA; REACH SVHC: No SVHC; Case/Package: SOT-23; Contact Plating: Gold; Termination: SMD/SMT; RoHS Compliant: Yes; Tolerance: 15%; Max Supply Voltage: 5.5V; Radiation Hardening: No; Max Operating Temperature: 125°C
J2 J5 = M20-9980346: Package: None; Price: None; Value: *; MP: M20-9980346; Availability: Unavailable